# EasyEDA Pro project Example_Quick Start.eprj

# Schematic Schematic
Create Date: 2022-01-21; Page Name: P1; Project Name: Example_Quick Start; Schematic Name: Schematic; Update Date: 2022-05-16; Company: EasyEDA Pro; Drawed: EasyEDA; Reviewed: EasyEDA
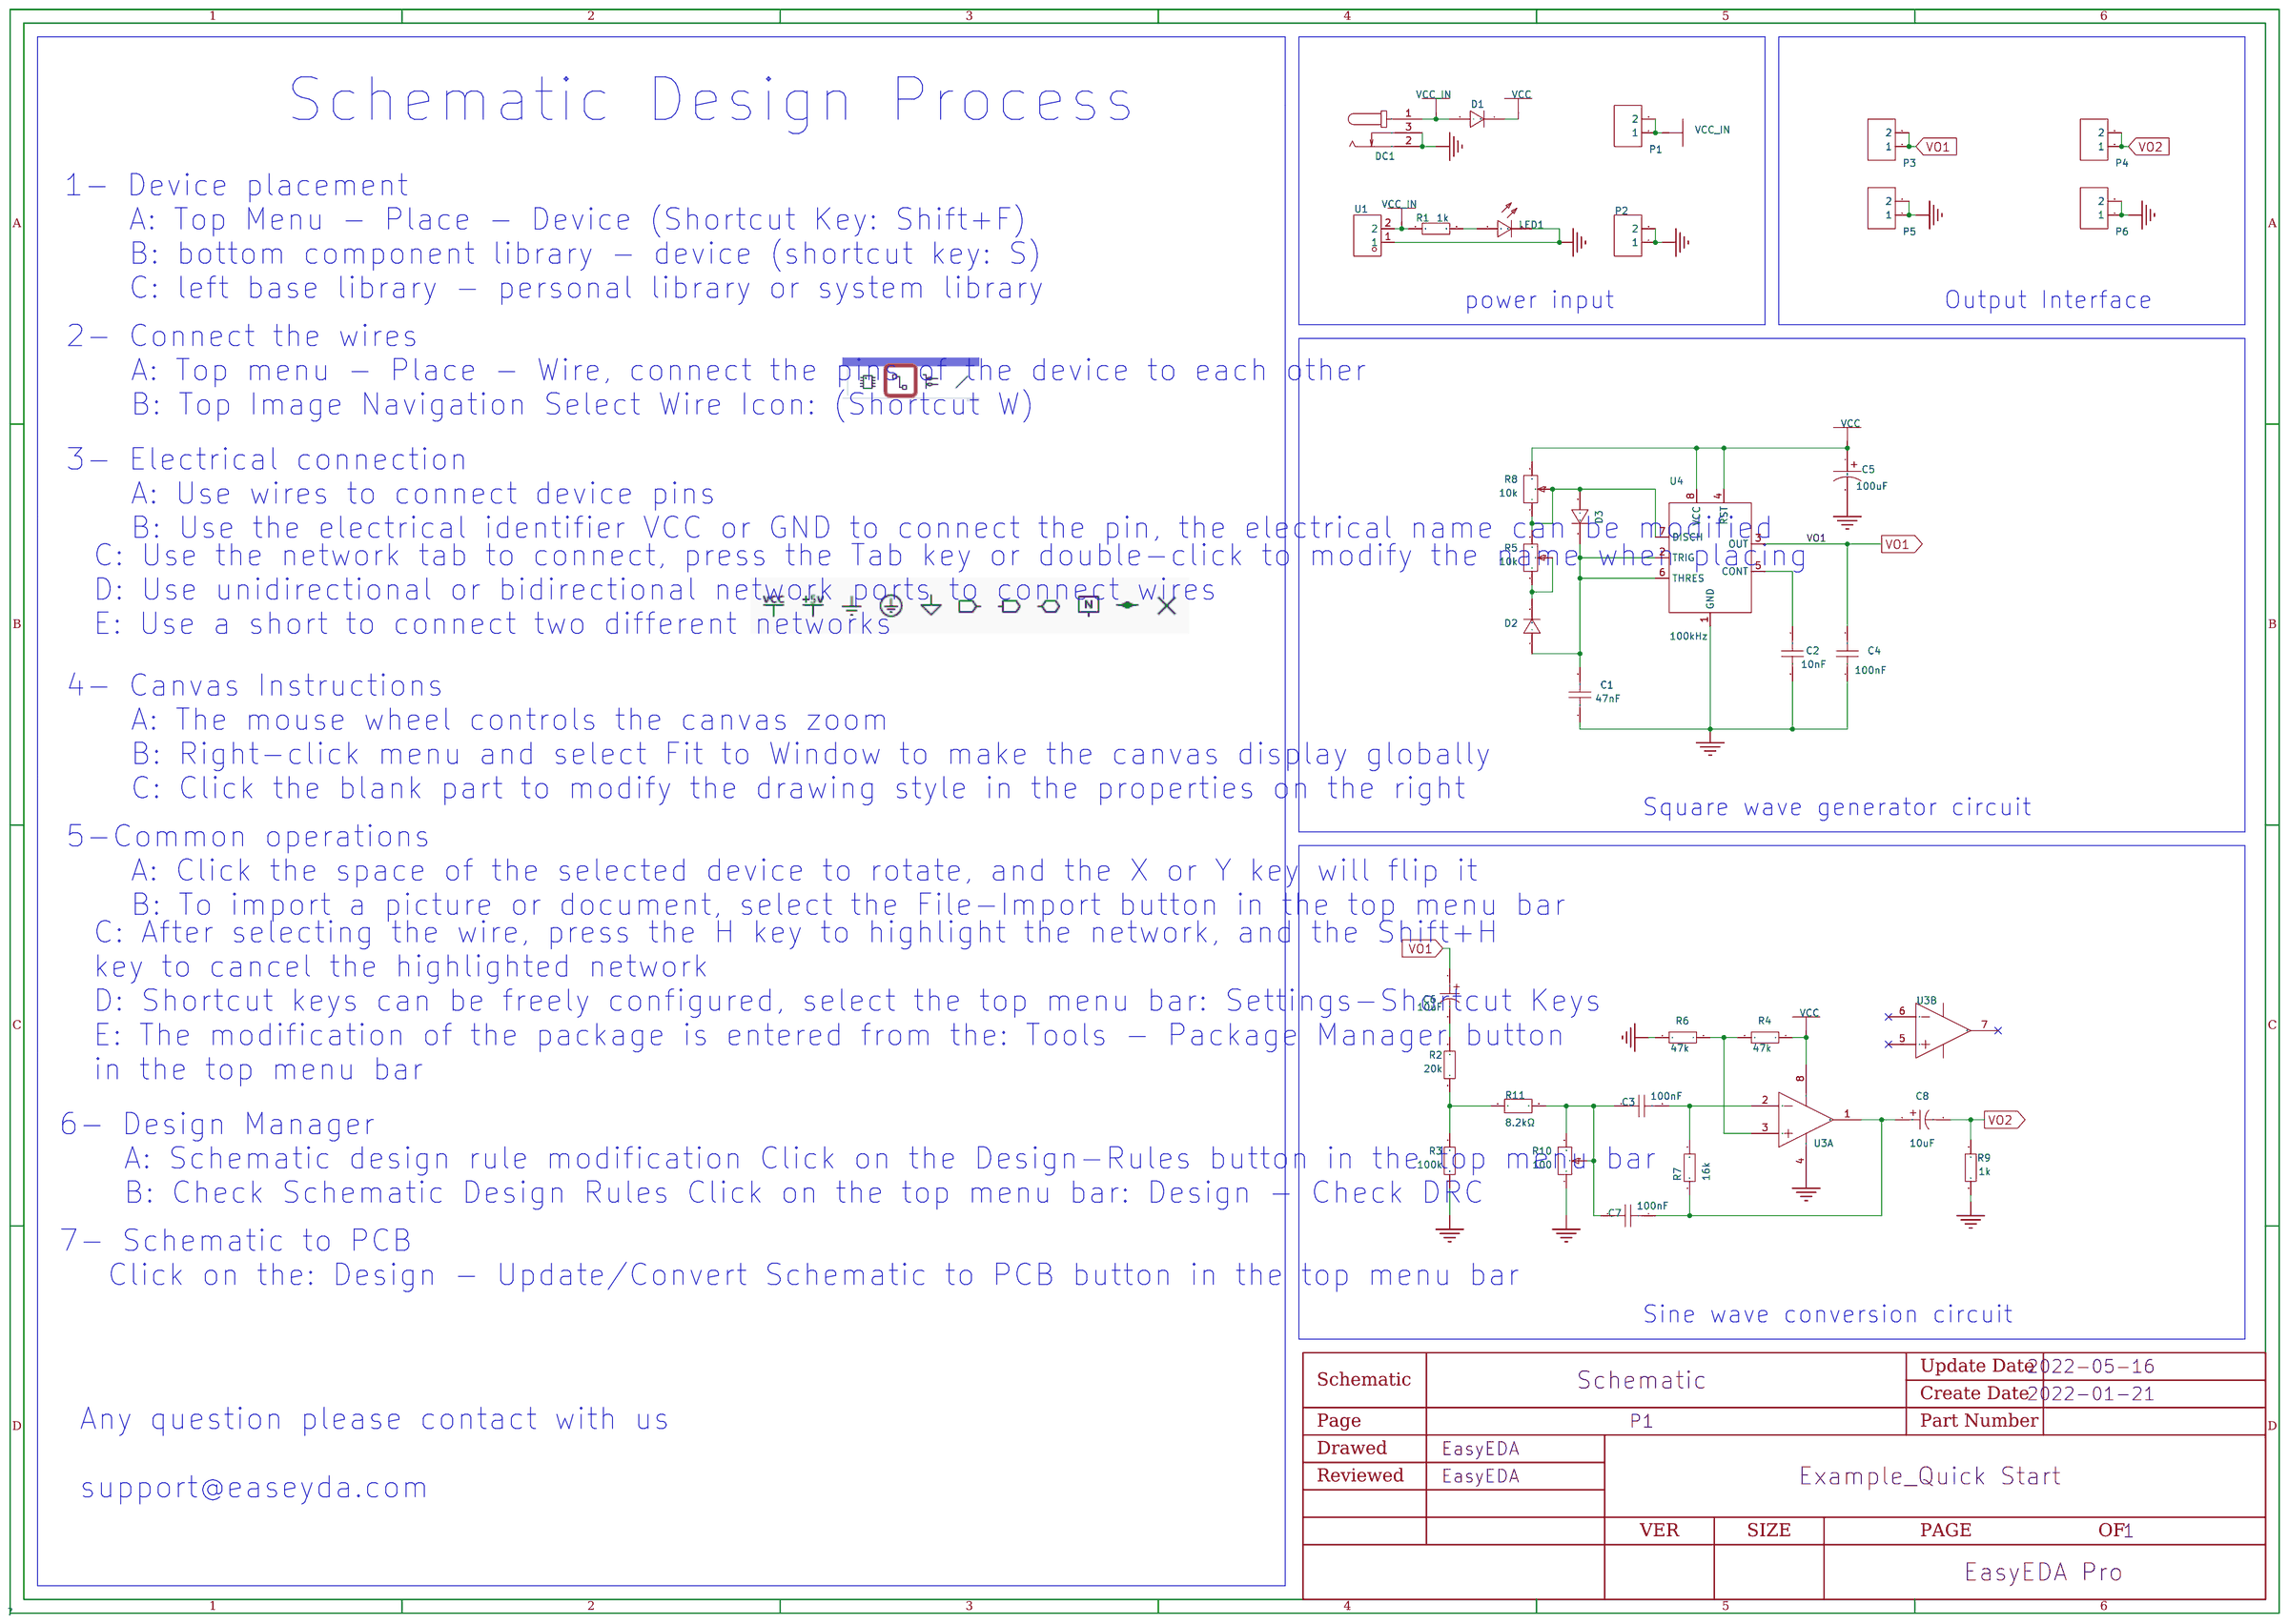
[diagram p0: schematic sheet]

## Parts
C1  47nF  [CAP-TH_L6.5-W3.0-P5.00-D0.6]
C2  10nF  [CAP-TH_L6.5-W3.0-P5.00-D0.6]
C3  100nF  [CAP-TH_L6.5-W3.0-P5.00-D0.6]
C4  100nF  [CAP-TH_L6.5-W3.0-P5.00-D0.6]
C5  100uF  [CAP-TH_BD5.0-P2.00-D0.5-FD]
C6  10uF  [CAP-TH_BD5.0-P2.00-D0.5-FD]
C7  100nF  [CAP-TH_L6.5-W3.0-P5.00-D0.6]
C8  10uF  [CAP-TH_BD5.0-P2.00-D0.5-FD]
D1  -  [DO-35_BD2.0-L4.2-P8.20-D0.5-RD]
D2  -  [DO-35_BD2.0-L4.2-P8.20-D0.5-RD]
D3  -  [DO-35_BD2.0-L4.2-P8.20-D0.5-RD]
DC1  -  [DC-IN-TH_DC005-T20]
LED1  -  [LED-TH_BD3.8-P2.54-FD]
P1  -  [HDR-TH_2P-P2.54-V-F]
P2  -  [HDR-TH_2P-P2.54-V-F]
P3  -  [HDR-TH_2P-P2.54-V-F]
P4  -  [HDR-TH_2P-P2.54-V-F]
P5  -  [HDR-TH_2P-P2.54-V-F]
P6  -  [HDR-TH_2P-P2.54-V-F]
R1  1k  [RES-TH_BD2.2-L6.5-P10.50-D0.6]
R2  20k  [RES-TH_BD2.2-L6.5-P10.50-D0.6]
R3  100k  [RES-TH_BD2.5-L6.5-P10.50-D0.6]
R4  47k  [RES-TH_BD2.4-L6.3-P10.30-D0.6]
R5  10k  [RES-ADJ-TH_3296W]
R6  47k  [RES-TH_BD2.4-L6.3-P10.30-D0.6]
R7  16k  [RES-TH_BD2.4-L6.3-P10.30-D0.6]
R8  10k  [RES-ADJ-TH_3296W]
R9  1k  [RES-TH_BD2.2-L6.5-P10.50-D0.6]
R10  100  [RES-ADJ-TH_3296W]
R11  8.2kΩ  [RES-TH_BD2.3-L6.5-P10.50-D0.5]
U1  -  [CONN-TH_2P-P5.00_DB301V-5.0-2P-BU-P]
U3  -  [DIP-8_L9.6-W6.4-P2.54-LS7.6-BL-1]  (sections 1,2)
U4  100kHz  [PDIP-8_L9.5-W6.4-P2.54-LS7.6-BL]

## Library data of the parts
C1 = CD1H473KC9BER1E000: 容值:47nF;精度:±10%;额定电压:50V;温度系数:X7R;; LCSC Part Name: 47nF ±10% 50V; Supplier Part: C263197; Manufacturer: Dersonic(德尔创); Supplier Footprint: 径向引线,P=5.08mm; JLCPCB Part Class: Extended Part; Datasheet: https://atta.szlcsc.com/upload/public/pdf/source/20200826/C263197_664386D170852956D467882687EE974D.pdf; Supplier: LCSC; Tolerance: ±10%; Voltage Rated: 50V; Temperature Coefficient: X7R
C2 = ct4-0805b103k500f1: 容值:10nF;精度:±10%;额定电压:50V;温度系数:X7R;; LCSC Part Name: 10nF ±10% 50V; Supplier Part: C169112; Manufacturer: FH(风华); Manufacturer Part: CT4-0805B103K500F1; Supplier Footprint: 径向引线,P=2.54mm; JLCPCB Part Class: Extended Part; Datasheet: https://atta.szlcsc.com/upload/public/pdf/source/20180118/C169112_15162576831491279695.pdf; Supplier: LCSC; Tolerance: ±10%; Voltage Rated: 50V; Temperature Coefficient: X7R
C3 C4 C7 = DCS104M26Y5UF6FJ5A0: 容值:100nF;精度:±20%;额定电压:50V;温度系数:Y5U;脚间距:5mm;; LCSC Part Name: 100nF ±20% 50V; Supplier Part: C2896063; Manufacturer: SHM(南方宏明); LCSC Stock: 1045; LCSC On Sale: 1; Supplier Footprint: 径向引线,P=5mm; Price: 0.142; JLCPCB Part Class: Extended Part; JLCPCB Stock: 0; JLCPCB On Sale: 0; Datasheet: https://atta.szlcsc.com/upload/public/pdf/source/20210926/5108EA716B26000394C19365B75013E5.pdf; Supplier: LCSC; Tolerance: ±20%; Voltage Rated: 50V; Temperature Coefficient: Y5U; Lead Spacing: 5mm
C5 = rf063m101lo8*16ta-1a1e: 容值:100uF;精度:±20%;额定电压:63V;电容体直径:8mm;电容体长度:16mm;脚间距:3.5mm;纹波电流:-;等效串联电阻:-;工作寿命:5000hrs@105;工作温度:-;; LCSC Part Name: 100uF ±20% 63V; Supplier Part: C516329; Manufacturer: BERYL(绿宝石); Manufacturer Part: RF063M101LO8*16TA-1A1E; Supplier Footprint: 径向引线,8x16mm; JLCPCB Part Class: Extended Part; Datasheet: https://atta.szlcsc.com/upload/public/pdf/source/20200423/C516329_319B046443BB3C1A7EBF366D791346F1.pdf; Supplier: LCSC; Tolerance: ±20%; Rated Voltage: 63V; φD: 8mm; L: 16mm; Lead Spacing: 3.5mm; Lifetime @ Temp: 5000hrs@105
C6 C8 = LW100M2501017PV4_1: 容值:10uF;精度:±20%;额定电压:250V;电容体直径:10mm;电容体长度:20mm;脚间距:5mm;纹波电流:200mA@100kHz;等效串联电阻:4Ω@100kHz;工作寿命:2000hrs@105℃;工作温度:-40℃~+105℃;; LCSC Part Name: 10uF ±20% 250V; Supplier Part: C2847239; Manufacturer: UNITED(怡德); Manufacturer Part: LW100M2501017PV4; Supplier Footprint: 径向引线,10x20mm; JLCPCB Part Class: Extended Part; Datasheet: https://atta.szlcsc.com/upload/public/pdf/source/20210723/C2847239_147AA3FCC1C7F46DE6816FDB6113BC95.pdf; Supplier: LCSC; Tolerance: ±20%; Rated Voltage: 250V; φD: 10mm; L: 20mm; Lead Spacing: 5mm; Ripple Current: 200mA@100kHz; Equivalent Series Resistance(ESR): 4Ω@100kHz; Lifetime @ Temp: 2000hrs@105℃; Operating Temperature: -40℃~+105℃
D1-D3 = 1N4148TR: 二极管配置:-;功率:500mW;直流反向耐压(Vr):100V;平均整流电流(Io):200mA;正向压降(Vf):1V@10mA;反向电流(Ir):5A@75V;反向恢复时间(trr):4ns;工作温度:-55~+175@(Tj);; LCSC Part Name: 100V 200mA 4ns; Supplier Part: C84410; Manufacturer: onsemi(安森美); Supplier Footprint: DO-35; JLCPCB Part Class: Extended Part; Datasheet: https://atta.szlcsc.com/upload/public/pdf/source/20161024/1477288632860.pdf; Supplier: LCSC; Power Dissipation: 500mW; Reverse Voltage (Vr): 100V; Average Rectified Current (Io): 200mA; Forward Voltage (Vf@If): 1V@10mA; Reverse Leakage Current: 5A@75V; Reverse Recovery Time (trr): 4ns; Operating Temperature: -55~+175@(Tj)
DC1 = DC005-T20_2: 触点内径:-;触点外径:-;额定电流:-;额定电压:-;; LCSC Part Name: DC连接器/DC005-2.0MM  B级 全铜 B级 全铜; Supplier Part: C111567; Manufacturer: SOFNG(硕方); Manufacturer Part: DC005-T20; Supplier Footprint: 插件; JLCPCB Part Class: Extended Part; Datasheet: https://atta.szlcsc.com/upload/public/pdf/source/20170519/1495157966733.pdf; Supplier: LCSC
LED1 = 204-10sdrd/s530-a3-l: 发光颜色:红灯;; LCSC Part Name: 3MM  红发红光; Supplier Part: C84774; Manufacturer: EVERLIGHT(台湾亿光); Manufacturer Part: 204-10SDRD/S530-A3-L; Supplier Footprint: 插件; JLCPCB Part Class: Extended Part; Datasheet: https://atta.szlcsc.com/upload/public/pdf/source/20170717/C84774_1500286941158822251.pdf; Supplier: LCSC; Emitted Color: 红灯
P1-P6 = 2.54-1*2P母: 间距:2.54mm;总孔位数:2;排数:1;插孔结构:1x2P;行距:-;安装类型:直插;塑高:-;触头材质:-;触头镀层:-;; LCSC Part Name: 2.54mm; Supplier Part: C49661; Manufacturer: BOOMELE(博穆精密); Supplier Footprint: 插件,P=2.54mm; JLCPCB Part Class: Extended Part; Datasheet: https://atta.szlcsc.com/upload/public/pdf/source/20151109/1457707570988.pdf; Supplier: LCSC; Pitch: 2.54mm; Number of Holes: 2; Number of Rows: 1; Holes Structure: 1x2P; Mounting Type: 直插
R1 R9 = mfr-25jt-52-1k: 电阻类型:金属膜电阻;阻值:1k;精度:±5%;功率:250mW;工作温度范围:-;; LCSC Part Name: 1k ±5% 250mW; Supplier Part: C176465; Manufacturer: YAGEO(国巨); Manufacturer Part: MFR-25JT-52-1K; Supplier Footprint: 轴向引线; JLCPCB Part Class: Extended Part; Datasheet: https://atta.szlcsc.com/upload/public/pdf/source/20180412/C176465_B1D61A567F5A7ED09D93828451981E7D.pdf; Supplier: LCSC; Type: 金属膜电阻; Tolerance: ±5%; Power(Watts): 250mW
R2 = mfr0w4f2002a50: 电阻类型:金属膜电阻;阻值:20k;精度:±1%;功率:250mW;温度系数:±50ppm/;工作温度范围:-;; LCSC Part Name: 20k ±1% 250mW; Supplier Part: C58594; Manufacturer: UNI-ROYAL(厚声); Manufacturer Part: MFR0W4F2002A50; Supplier Footprint: 轴向引线; JLCPCB Part Class: Extended Part; Datasheet: https://atta.szlcsc.com/upload/public/pdf/source/20170615/1497511037942.pdf; Supplier: LCSC; Type: 金属膜电阻; Tolerance: ±1%; Power(Watts): 250mW; Temperature Coefficient: ±50ppm/
R3 = mfr0w4f1003a50: 电阻类型:金属膜电阻;阻值:100k;精度:±1%;功率:250mW;温度系数:±50ppm/;工作温度范围:-;; LCSC Part Name: 100k ±1% 250mW; Supplier Part: C58597; Manufacturer: UNI-ROYAL(厚声); Manufacturer Part: MFR0W4F1003A50; Supplier Footprint: 轴向引线; JLCPCB Part Class: Extended Part; Datasheet: https://atta.szlcsc.com/upload/public/pdf/source/20170615/1497511038881.pdf; Supplier: LCSC; Type: 金属膜电阻; Tolerance: ±1%; Power(Watts): 250mW; Temperature Coefficient: ±50ppm/
R4 R6 = mfr-25fte52-47k: 电阻类型:金属膜电阻;阻值:47k;精度:±1%;功率:250mW;温度系数:±50ppm/;工作温度范围:-;; LCSC Part Name: 47k ±1% 250mW; Supplier Part: C173021; Manufacturer: YAGEO(国巨); Manufacturer Part: MFR-25FTE52-47K; Supplier Footprint: 轴向引线; JLCPCB Part Class: Extended Part; Datasheet: https://atta.szlcsc.com/upload/public/pdf/source/20180420/C173021_7AD4F1B81C478ED33B405AE8A1C191A6.pdf; Supplier: LCSC; Type: 金属膜电阻; Tolerance: ±1%; Power(Watts): 250mW; Temperature Coefficient: ±50ppm/
R5 R8 = 3296w-1-103_c330432: 阻值:10k;精度:±10%;温度系数:±250ppm/;; LCSC Part Name: 10k ±10%; Supplier Part: C330432; Manufacturer: BOCHEN(博晨); Manufacturer Part: 3296W-1-103; Supplier Footprint: 插件; JLCPCB Part Class: Extended Part; Datasheet: https://atta.szlcsc.com/upload/public/pdf/source/20181127/C330432_1E3D0FAFEECED03876733B6304362580.pdf; Supplier: LCSC; Tolerance: ±10%; Temperature Coefficient: ±250ppm/
R7 = mf1/4w ±1% 16k stb5: 电阻类型:金属膜电阻;阻值:16k;精度:±1%;功率:250mW;温度系数:±350ppm/;最大工作电压:250V;工作温度范围:-55~+155;; LCSC Part Name: 16k ±1% 250mW; Supplier Part: C337151; Manufacturer: VO(翔胜); Manufacturer Part: MF1/4W ±1% 16K STB5; Supplier Footprint: 轴向引线; JLCPCB Part Class: Extended Part; Datasheet: https://atta.szlcsc.com/upload/public/pdf/source/20181224/C337151_F9580EBD41013FCE755A16D7F2B5866E.pdf; Supplier: LCSC; Type: 金属膜电阻; Tolerance: ±1%; Power(Watts): 250mW; Temperature Coefficient: ±350ppm/; Overload Voltage (Max): 250V; Operating Temperature Range: -55~+155
R10 = 3296W-1-101LF: 阻值:100;精度:±10%;温度系数:±100ppm/;; LCSC Part Name: 100 ±10%; Supplier Part: C83688; Manufacturer: BOURNS; Supplier Footprint: 3296W; JLCPCB Part Class: Extended Part; Datasheet: https://atta.szlcsc.com/upload/public/pdf/source/20160920/1474356682992.pdf; Supplier: LCSC; Tolerance: ±10%; Temperature Coefficient: ±100ppm/
R11 = MF1/4W-8.2KΩ±1%T52_1: 电阻类型:金属膜电阻;阻值:8.2kΩ;精度:±1%;功率:250mW;温度系数:±200ppm/℃;工作温度范围:-;; LCSC Part Name: 8.2kΩ ±1% 250mW; Supplier Part: C714014; Manufacturer: 华星机电; Manufacturer Part: MF1/4W-8.2KΩ±1%T52; Supplier Footprint: 轴向引线; JLCPCB Part Class: Extended Part; Datasheet: https://atta.szlcsc.com/upload/public/pdf/source/20200731/C713882_AE8EB1102749D7E4FB4FB13DC898C429.pdf; Supplier: LCSC; Type: 金属膜电阻; Tolerance: ±1%; Power(Watts): 250mW; Temperature Coefficient: ±200ppm/℃
U1 = DB301V-5.0-2P-BU-P: 间距:5mm;排数:1;每排PIN数:2;安装方式:直针;额定电流:17.5A;额定电压:250V;线规 - AWG:14~22;线规 - mm?:0.75~1.5;工作温度范围:-30~+120;颜色:蓝色;; LCSC Part Name: 5mm 排数:1 每排P数:2 直针; Supplier Part: C430621; Manufacturer: DIBO(地博电气); Supplier Footprint: P=5mm; JLCPCB Part Class: Extended Part; Datasheet: https://atta.szlcsc.com/upload/public/pdf/source/20191217/C430621_0E4ACE8E676D4E51FA492CCC12678E45.pdf; Supplier: LCSC; Pitch: 5mm; Number of Rows: 1; Number of PINs Per Row: 2; Mounting Style: 直针; Current Rating (Max): 17.5A; Voltage Rating (Max): 250V; Wire Gauge - AWG: 14~22; Wire Gauge - mm?: 0.75~1.5; Operating Temperature Range: -30~+120; Color: 蓝色
U3 = TL072CP_1: 运放类型:J-FET;放大器组数:2;增益带宽积（GBP）:3MHz;压摆率（SR）:13 V/us;电源电压:7V~36V,±3.5V~18V;各通道供电电流:1.4mA;; LCSC Part Name: TL072CP; Supplier Part: C7236; Manufacturer: TI(德州仪器); Manufacturer Part: TL072CP; Supplier Footprint: DIP-8; JLCPCB Part Class: Extended Part; Datasheet: https://atta.szlcsc.com/upload/public/pdf/source/20140704/1457707129967.pdf; Supplier: LCSC; Amplifier Type: J-FET; Number of Circuits: 2; Gain Bandwidth Product（GBP）: 3MHz; Slew Rate（SR）: 13 V/us; Supply Voltage（Single）: 7V~36V,±3.5V~18V; Iq per channel (Typ): 1.4mA; Operating Temperature: 0°C ~ 70°C
U4 = ne555dr: 类型:555 型，计时器/振荡器(单路);计数:-;频率:100kHz;工作电压:4.5V~16V;工作电流:10mA;工作温度:0~+70;; LCSC Part Name: NE555DR; Supplier Part: C7593; Manufacturer: TI(德州仪器); Manufacturer Part: NE555DR; Supplier Footprint: SOIC-8_150mil; JLCPCB Part Class: Basic Part; Datasheet: https://atta.szlcsc.com/upload/public/pdf/source/20140704/1457707116116.pdf; Supplier: LCSC; Type: 555 型，计时器/振荡器(单路); Supply Voltage: 4.5V~16V; Supply Current: 10mA; Operating Temperature: 0~+70

## Nets
GND: C1.1 C2.2 C4.1 C5.2 DC1.2 DC1.3 LED1.2(C) P2.1 P2.2 P5.1 P5.2 P6.1 P6.2 R3.1 R6.2 R9.1 R10.1 U1.1 U3.4(VCC-) U4.1(GND)
VCC: C5.1 D1.1(C) R4.1 R8.3 U3.8(VCC+) U4.4(RST) U4.8(VCC)
VCC_IN: D1.2(A) DC1.1 P1.1 P1.2 R1.1 U1.2
VO1: C4.2 C6.1 P3.1 P3.2 U4.3(OUT)
VO2: C8.2 P4.1 P4.2 R9.2
$1N6954: LED1.1(A) R1.2
$1N9962: C2.1 U4.5(CONT)
$1N10436: D3.2(A) R5.3 R8.1 R8.2 U4.7(DISCH)
$1N13327: C6.2 R2.2
$1N13796: R2.1 R3.2 R11.1
$1N14821: C3.2 C7.2 R10.2 R10.3 R11.2
$1N15445: C7.1 C8.1 R7.1 U3.1(OUT1)
$1N15475: C3.1 R7.2 U3.2(IN1-)
$1N15740: R4.2 R6.1 U3.3(IN1+)
$1N22192: C1.2 D2.2(A) D3.1(C) U4.2(TRIG) U4.6(THRES)
Net-(D2-1): D2.1(C) R5.1 R5.2

Not connected (* = marked no-connect by the designer): U3 5(IN2+)* 6(IN2-)* 7(OUT2)*

## Notes on the sheet
- Schematic Design Process
- 1- Device placement
      A: Top Menu - Place - Device (Shortcut Key: Shift+F)
      B: bottom component library - device (shortcut key: S)
      C: left base library - personal library or system library
- 2- Connect the wires
      A: Top menu - Place - Wire, connect the pins of the device to each other
      B: Top Image Navigation Select Wire Icon: (Shortcut W)
- power input
- Output Interface
- 3- Electrical connection
      A: Use wires to connect device pins
      B: Use the electrical identifier VCC or GND to connect the pin, the electrical name can be modified
- C: Use the network tab to connect, press the Tab key or double-click to modify the name when placing
  D: Use unidirectional or bidirectional network ports to connect wires
  E: Use a short to connect two different networks
- 4- Canvas Instructions
      A: The mouse wheel controls the canvas zoom
      B: Right-click menu and select Fit to Window to make the canvas display globally
      C: Click the blank part to modify the drawing style in the properties on the right
- 5-Common operations
      A: Click the space of the selected device to rotate, and the X or Y key will flip it
      B: To import a picture or document, select the File-Import button in the top menu bar
- Square wave generator circuit
- C: After selecting the wire, press the H key to highlight the network, and the Shift+H
  key to cancel the highlighted network
  D: Shortcut keys can be freely configured, select the top menu bar: Settings-Shortcut Keys
- E: The modification of the package is entered from the: Tools - Package Manager button
  in the top menu bar
- 6- Design Manager
      A: Schematic design rule modification Click on the Design-Rules button in the top menu bar
      B: Check Schematic Design Rules Click on the top menu bar: Design - Check DRC
- 7- Schematic to PCB
     Click on the: Design - Update/Convert Schematic to PCB button in the top menu bar
- Sine wave conversion circuit
- Any question please contact with us
  support@easeyda.com

# Board PCB
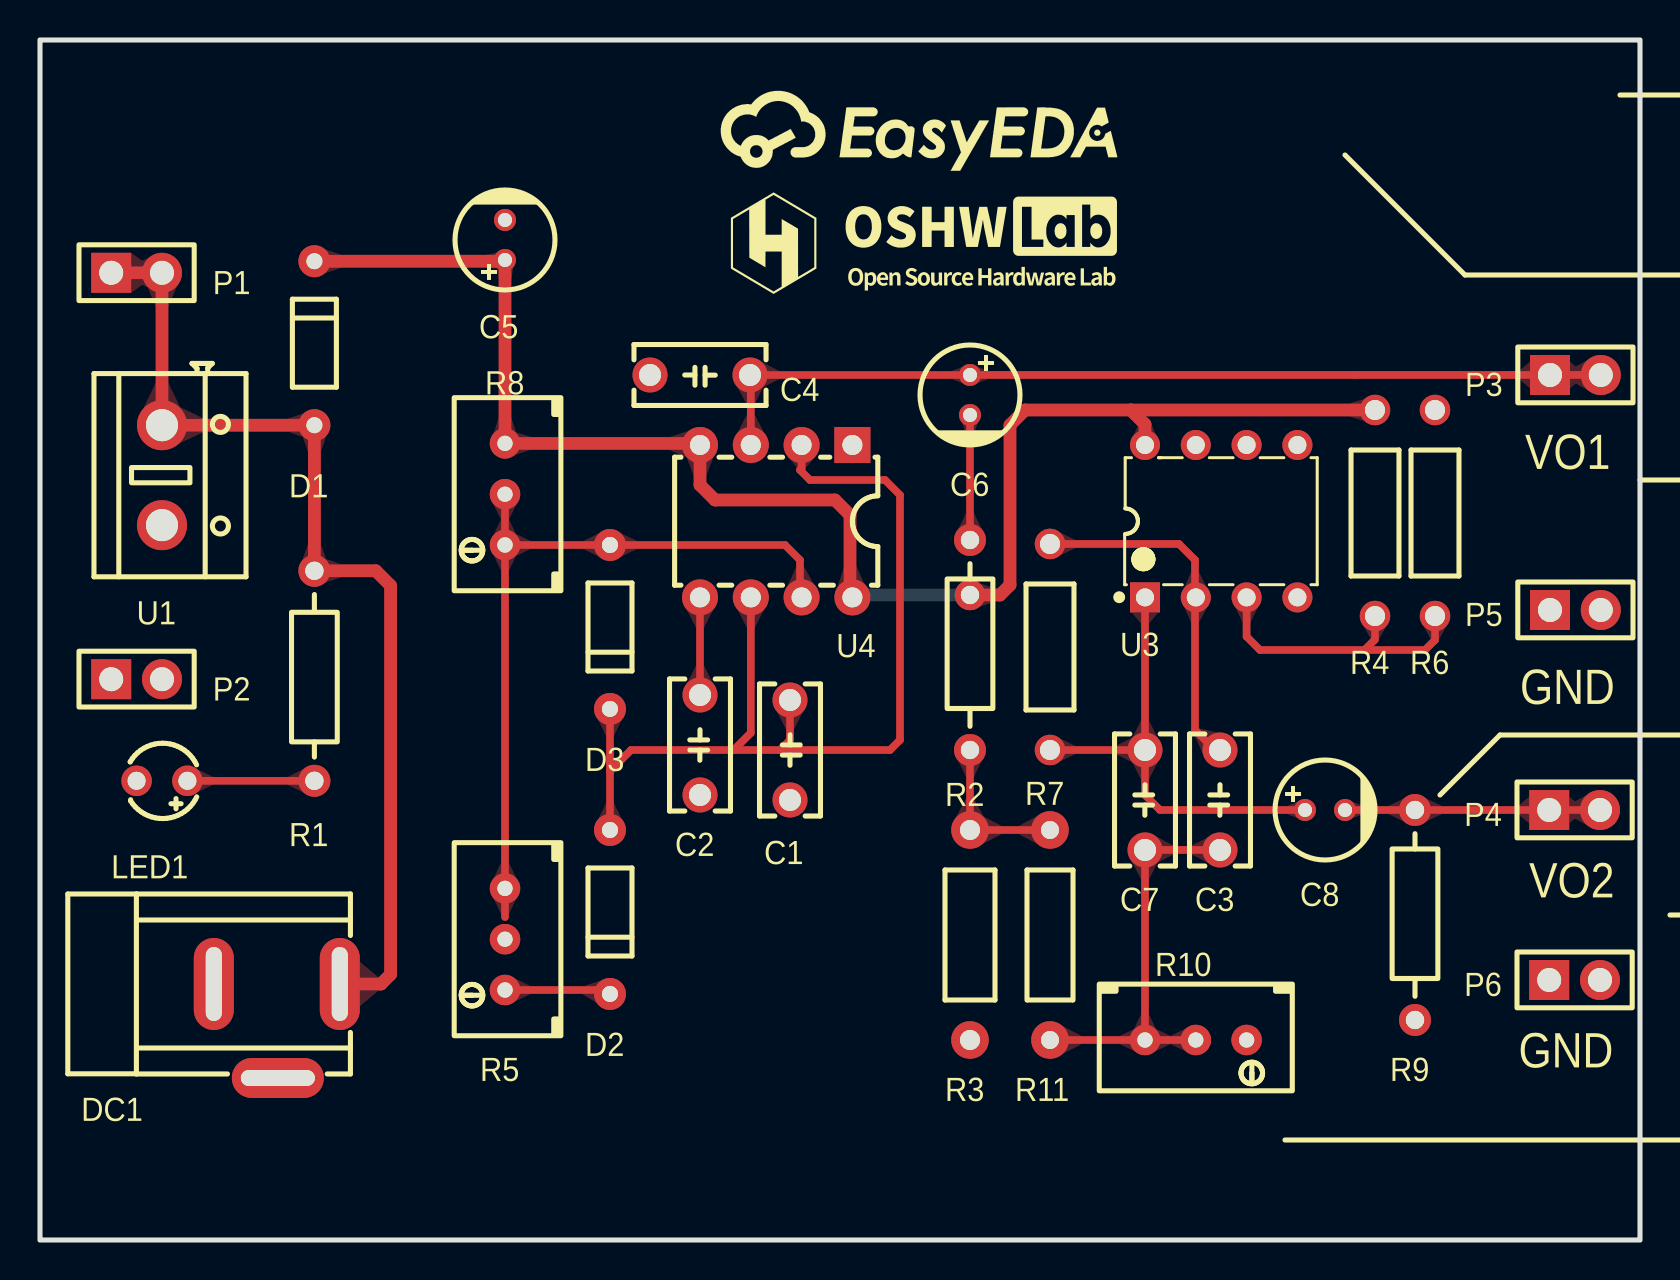
[diagram p1: board, top side]
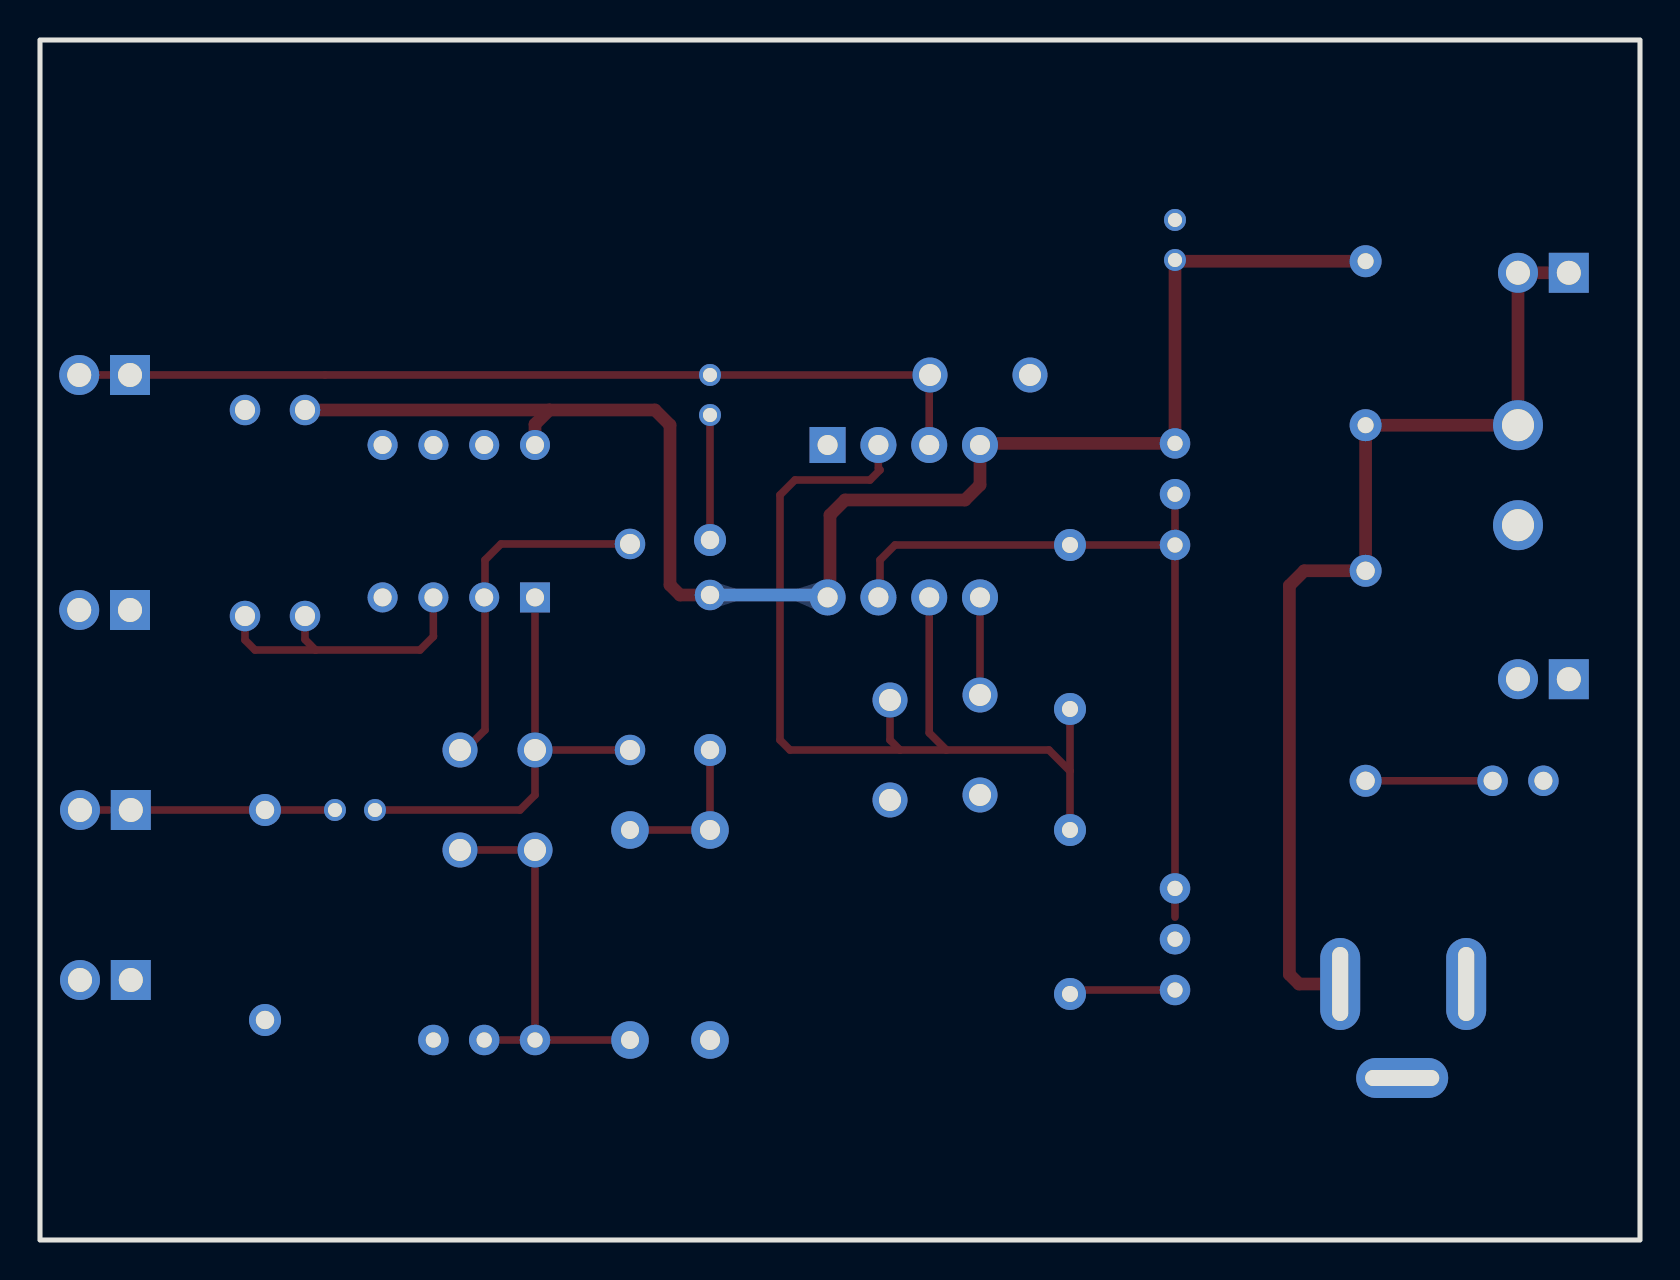
[diagram p2: board, bottom side, seen from below]

Outline 80 x 60 mm; copper layers: Top Layer, Bottom Layer. Coordinates in mm from the lower left corner of the outline.
Outline path: rectangle 0,60 80,0
Stack: Top Layer 0.035mm / 介电1 1.51mm FR4 er 4.5 / Bottom Layer 0.035mm

## Design rules (mm)
spacing safeClearance (default): track to track 0.152, other pairs 0.152 to 0.3
track width trackWidth (default): min 0.127, default 0.381, max 2.54
track width VCC: min 0.127, default 0.635, max 2.54
differential pair differentialPair (default): width min 0.127, default 0.254, max 2.54; gap min 0.152, default 0.152
via viaSize (default): diameter min 0.5, default 0.61, max 10; hole min 0.3, default 0.305, max 6
net VCC uses VCC

## Placement (name value [footprint] x y rotation side)
C1  47nF  [CAP-TH_L6.5-W3.0-P5.00-D0.6]  37.5 24.5 90 top
C2  10nF  [CAP-TH_L6.5-W3.0-P5.00-D0.6]  33 24.75 270 top
C3  100nF  [CAP-TH_L6.5-W3.0-P5.00-D0.6]  59 22 270 top
C4  100nF  [CAP-TH_L6.5-W3.0-P5.00-D0.6]  33 43.25 0 top
C5  100uF  [CAP-TH_BD5.0-P2.00-D0.5-FD]  23.25 50 90 top
C6  10uF  [CAP-TH_BD5.0-P2.00-D0.5-FD]  46.5 42.25 270 top
C7  100nF  [CAP-TH_L6.5-W3.0-P5.00-D0.6]  55.25 22 270 top
C8  10uF  [CAP-TH_BD5.0-P2.00-D0.5-FD]  64.25 21.5 0 top
D1  -  [DO-35_BD2.0-L4.2-P8.20-D0.5-RD]  13.72 44.84 270 top
D2  -  [DO-35_BD2.0-L4.2-P8.20-D0.5-RD]  28.5 16.4 90 top
D3  -  [DO-35_BD2.0-L4.2-P8.20-D0.5-RD]  28.5 30.65 90 top
DC1  -  [DC-IN-TH_DC005-T20]  11.84 10.45 0 top
LED1  -  [LED-TH_BD3.8-P2.54-FD]  6.1 22.96 180 top
NOREF  -  [Pad_e313]  46.5 32.25 0 top
P1  -  [HDR-TH_2P-P2.54-V-F]  4.83 48.36 0 top
P2  -  [HDR-TH_2P-P2.54-V-F]  4.83 28.04 0 top
P3  -  [HDR-TH_2P-P2.54-V-F]  76.77 43.25 0 top
P4  -  [HDR-TH_2P-P2.54-V-F]  76.73 21.5 0 top
P5  -  [HDR-TH_2P-P2.54-V-F]  76.77 31.5 0 top
P6  -  [HDR-TH_2P-P2.54-V-F]  76.73 13 0 top
R1  1k  [RES-TH_BD2.2-L6.5-P10.50-D0.6]  13.72 28.21 270 top
R2  20k  [RES-TH_BD2.2-L6.5-P10.50-D0.6]  46.5 29.75 90 top
R3  100k  [RES-TH_BD2.5-L6.5-P10.50-D0.6]  46.5 15.25 90 top
R4  47k  [RES-TH_BD2.4-L6.3-P10.30-D0.6]  66.75 36.35 270 top
R5  10k  [RES-ADJ-TH_3296W]  23.25 15.04 180 top
R6  47k  [RES-TH_BD2.4-L6.3-P10.30-D0.6]  69.75 36.35 90 top
R7  16k  [RES-TH_BD2.4-L6.3-P10.30-D0.6]  50.5 29.65 90 top
R8  10k  [RES-ADJ-TH_3296W]  23.25 37.29 180 top
R9  1k  [RES-TH_BD2.2-L6.5-P10.50-D0.6]  68.75 16.25 90 top
R10  100  [RES-ADJ-TH_3296W]  57.79 10 270 top
R11  8.2kΩ  [RES-TH_BD2.3-L6.5-P10.50-D0.5]  50.5 15.25 270 top
U1  -  [CONN-TH_2P-P5.00_DB301V-5.0-2P-BU-P]  6.1 38.24 90 top
U3  -  [DIP-8_L9.6-W6.4-P2.54-LS7.6-BL-1]  59.06 35.94 0 top
U4  100kHz  [PDIP-8_L9.5-W6.4-P2.54-LS7.6-BL]  36.81 35.94 180 top

## Footprints (pads in the part's own frame, mm; a bottom-side part is the same pattern mirrored in y, then rotated)
CAP-TH_BD5.0-P2.00-D0.5-FD
  round 1.1 hole 0.701: 1(-1.001,0) 2(1.001,0)
CAP-TH_L6.5-W3.0-P5.00-D0.6
  round 1.75 hole 1.1: 1(-2.499,0) 2(2.499,0)
CONN-TH_2P-P5.00_DB301V-5.0-2P-BU-P
  round 2.499 hole 1.6: 1(-2.499,0) 2(2.499,0)
DC-IN-TH_DC005-T20
  oval 1.999x4.6 hole 0.8x3.701: 1(3.15,2.349) 2(-3.15,2.349)
  oval 4.6x1.999 hole 3.701x0.8: 3(0.051,-2.349)
DIP-8_L9.6-W6.4-P2.54-LS7.6-BL-1
  rect 1.501x1.501 hole 0.899: 1(-3.81,-3.81)
  round 1.501 hole 0.899: 2(-1.27,-3.81) 3(1.27,-3.81) 4(3.81,-3.81) 5(3.81,3.81) 6(1.27,3.81) 7(-1.27,3.81) 8(-3.81,3.81)
DO-35_BD2.0-L4.2-P8.20-D0.5-RD
  round 1.6 hole 0.8: 1(-4.099,0) 2(4.099,0)
HDR-TH_2P-P2.54-V-F
  rect 1.999x1.999 hole 1.199: 1(-1.27,0)
  round 1.999 hole 1.199: 2(1.27,0)
LED-TH_BD3.8-P2.54-FD
  round 1.524 hole 0.899: 1(-1.27,0) 2(1.27,0)
Pad_e313
  round 1.524 hole 0.914: (0,0)
PDIP-8_L9.5-W6.4-P2.54-LS7.6-BL
  rect 1.801x1.801 hole 1.001: 1(-3.81,-3.81)
  round 1.801 hole 1.001: 2(-1.27,-3.81) 3(1.27,-3.81) 4(3.81,-3.81) 5(3.81,3.81) 6(1.27,3.81) 7(-1.27,3.81) 8(-3.81,3.81)
RES-ADJ-TH_3296W
  round 1.524 hole 0.762: 1(0,2.54) 2(0,0) 3(0,-2.54)
RES-TH_BD2.2-L6.5-P10.50-D0.6
  round 1.6 hole 0.914: 1(-5.25,0) 2(5.25,0)
RES-TH_BD2.3-L6.5-P10.50-D0.5
  round 1.879 hole 0.899: 1(-5.25,0) 2(5.25,0)
RES-TH_BD2.4-L6.3-P10.30-D0.6
  round 1.524 hole 1.001: 1(-5.151,0) 2(5.151,0)
RES-TH_BD2.5-L6.5-P10.50-D0.6
  round 1.879 hole 1: 1(-5.25,0) 2(5.25,0)

## Nets
As in the schematic, except:
VCC: C5.1 D1.1 NOREF. R4.1 R8.3 U3.8 U4.4 U4.8
$1N23204: D2.1 R5.1

Pads without a net: U3 5 6 7

## Routing (per net, layer and track width the routed paths; a pad name or vN(x,y) marks a point on that pad's centre or on a via; arc(x,y) is an arc through that point)
VCC: length 79.5
  Top Layer w0.635: 54.54,41.5 R4.1 ; 54.54,41.5 49.25,41.5 48.5,40.75 48.5,32.75 48,32.25 46.5,32.25 ; 54.54,41.5 55.25,40.79 U3.8 ; D1.1 23.19,48.94 C5.1 R8.3 32.67,39.83 32.75,39.75 U4.4 33,37.75 33.75,37 39.75,37 40.5,36.25 40.5,32.25 U4.8
  Bottom Layer w0.635: 46.5,32.25 40.74,32.25 U4.8
VCC_IN: length 51.4
  Top Layer w0.635: P1.1 P1.2 U1.2 D1.2 R1.1 16.79,33.46 17.53,32.72 17.53,13.28 17.05,12.8 DC1.1
VO1: length 47
  Top Layer w0.381: 75.5,43.25 77.29,43.25 ; 77.29,43.25 78.04,43.25 77.79,43.5 77.54,43.5 77.29,43.25 ; 46.5,43.25 C4.2 35.54,43.21 U4.3 ; 75.5,43.25 C6.1
VO2: length 12.7
  Top Layer w0.381: P4.2 P4.1 R9.2 C8.2
$1N6954: length 6.3
  Top Layer w0.381: R1.2 LED1.1
$1N9962: length 4.9
  Top Layer w0.381: U4.5 C2.1
$1N10436: length 38.1
  Top Layer w0.381: R8.2 R8.1 ; R8.1 R5.3 23.25,16.14 ; R8.1 D3.2 37.25,34.75 38,34 38,32.21 U4.7
$1N13327: length 6.2
  Top Layer w0.381: R2.2 C6.2
$1N13796: length 8
  Top Layer w0.381: R11.1 R3.2 R2.1
$1N14821: length 20.5
  Top Layer w0.381: R10.3 R10.2 ; R10.3 R11.2 ; R10.3 55.25,19.5 59,19.5
$1N15445: length 22.9
  Top Layer w0.381: R7.1 C7.1 ; C7.1 55.25,22.25 56,21.5 C8.1 ; C7.1 U3.1
$1N15475: length 17.7
  Top Layer w0.381: R7.2 56.95,34.8 57.75,34 57.75,25.5 58.75,24.5 C3.1
$1N15740: length 15
  Top Layer w0.381: U3.3 60.33,30.17 61,29.5 66.22,29.5 ; 66.22,29.5 69.25,29.5 69.75,30 R6.1 ; 66.22,29.5 66.75,30.03 R4.2
$1N22192: length 50.9
  Top Layer w0.381: 28.5,23.45 28.5,26.55 ; 28.5,23.45 29.55,24.5 34.68,24.5 ; 28.5,23.45 D2.2 ; C1.2 37.5,25 37,24.5 ; 37,24.5 34.68,24.5 ; 37,24.5 42.5,24.5 43,25 43,37.25 42.25,38 38.5,38 38,38.5 38.08,38.58 U4.2 ; 34.68,24.5 35.54,25.36 U4.6
$1N23204: length 5.3
  Top Layer w0.381: R5.1 28.3,12.5 D2.1

## Copper pours and planes (outline as drawn; the poured copper is in the pictures)
GND on Top Layer: -2.25,62.25 81.25,62.25 81.25,-2 -2.25,-2

Small or netless copper shapes (teardrops, artwork), in the pictures only: 82 on Top Layer, 2 on Bottom Layer

## Text on the board
Top Silkscreen Layer: GND | VO1 | VO2 | 1-Rule Settings: Set up PCB design rules / A: Select Design - Design Rules from the top menu bar / B: The default line width, maximum and minimum line width and other settings are all in it | 2- Design Check: Check the PCB for non-compliance with the rules / A: Select Design-DRC Check from the top menu bar / B: DRC check status pops up below the canvas, you can double-click to locate | 3-Grid and ALT grid: Set the minimum size of mobile devices or traces / A: The right-click menu calls out the grid size properties, each time you move the unit / size of grid / B: Select Settings-PCB/Package-General Rules from the top menu bar / Set the A | 4- Graphical preview / A: Select View - 2D Preview or 3D Preview in the top menu bar / B: Find the "2D" and "3D" buttons in the top graphics menu bar | 5-3D model modification / Top menu bar select Tools - 3D Model Manager | 6- Production file export / Common file export such as sitting board file, BOM table and Gerber: / One-click export in the top menu bar - file - export selection | Copper Region: large-area copper-filled function / 1-Select Placement-Copper Area in the top menu bar / 2-shift+B to rebuild the copper, Shift+M to show/hide the copper | Image import: Select Import - Image from the top file menu bar | Place Text: Text can be set as silkscreen layer for marking annotation / 1- Select Placement-Text in the top menu bar / 2- Find the "T" text in the top graphics menu bar | Placing Board Frames: Board Shape Settings / 1- Select Placement - Board Frame - Select Board Frame Style in the top menu bar / 2- Find the " " icon in the top graphics menu bar / 3- Use the polyline tool to freely draw the shape of the board frame and set it a | Teardrop additions: fixed pads and wires / Select Tools - Teardrop in the top menu bar | Expose copper: top layer + top layer solder mask overlap | Slots: Open non-metallized slots on the board / 1- Select Placement-Slotted Area-Circle in the top menu bar / 2- Select the " " icon in the top graph menu bar | PCB Design General Matters | 【Analog circuit】Waveform generation and transformation design circuit
